# EAGLE design sonar (EAGLE 5.11)
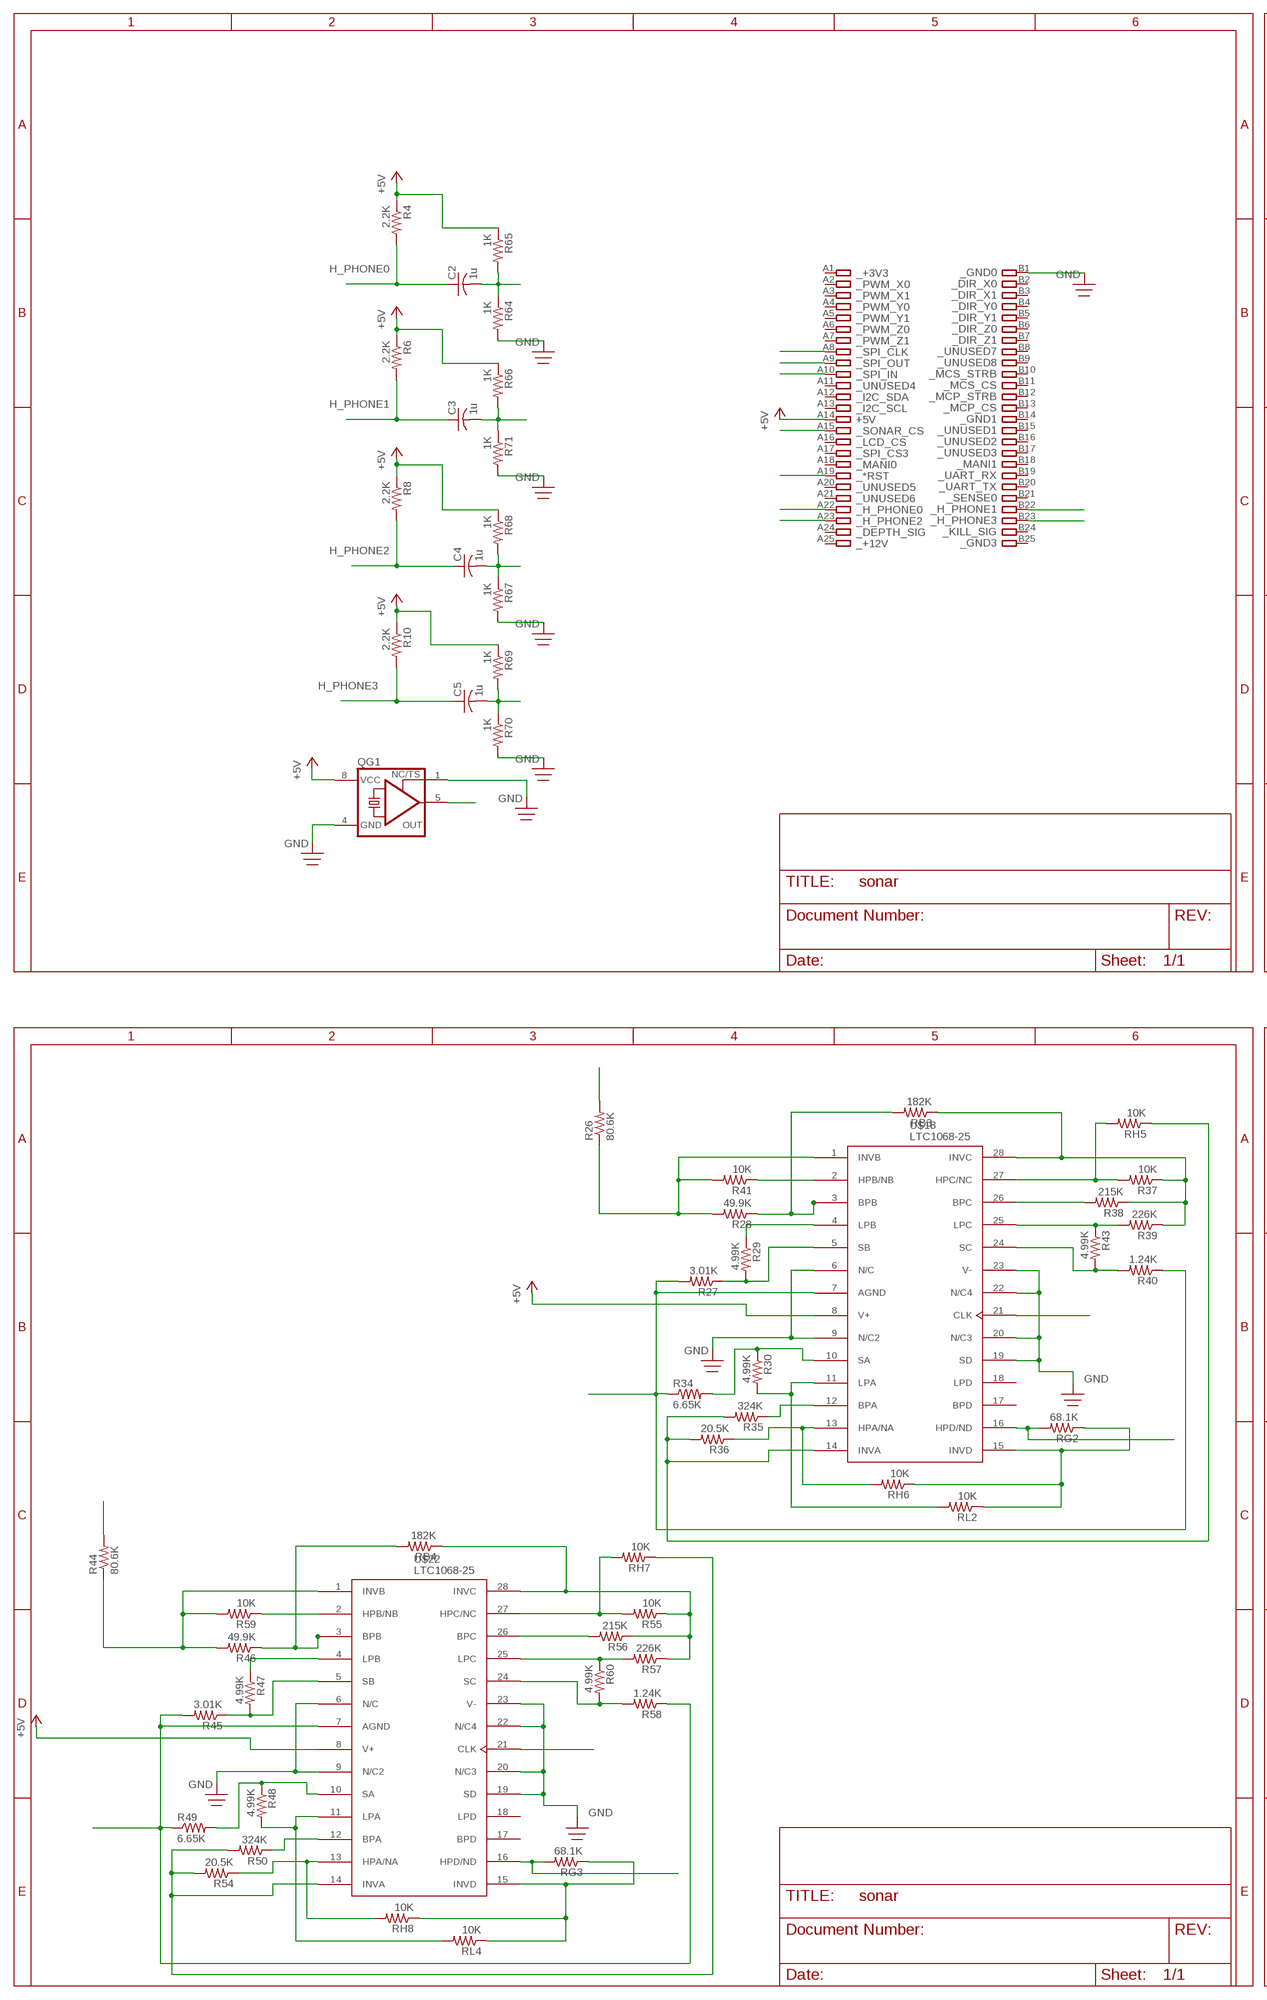
[diagram p0: schematic, sheet 1, part 1 of 2]
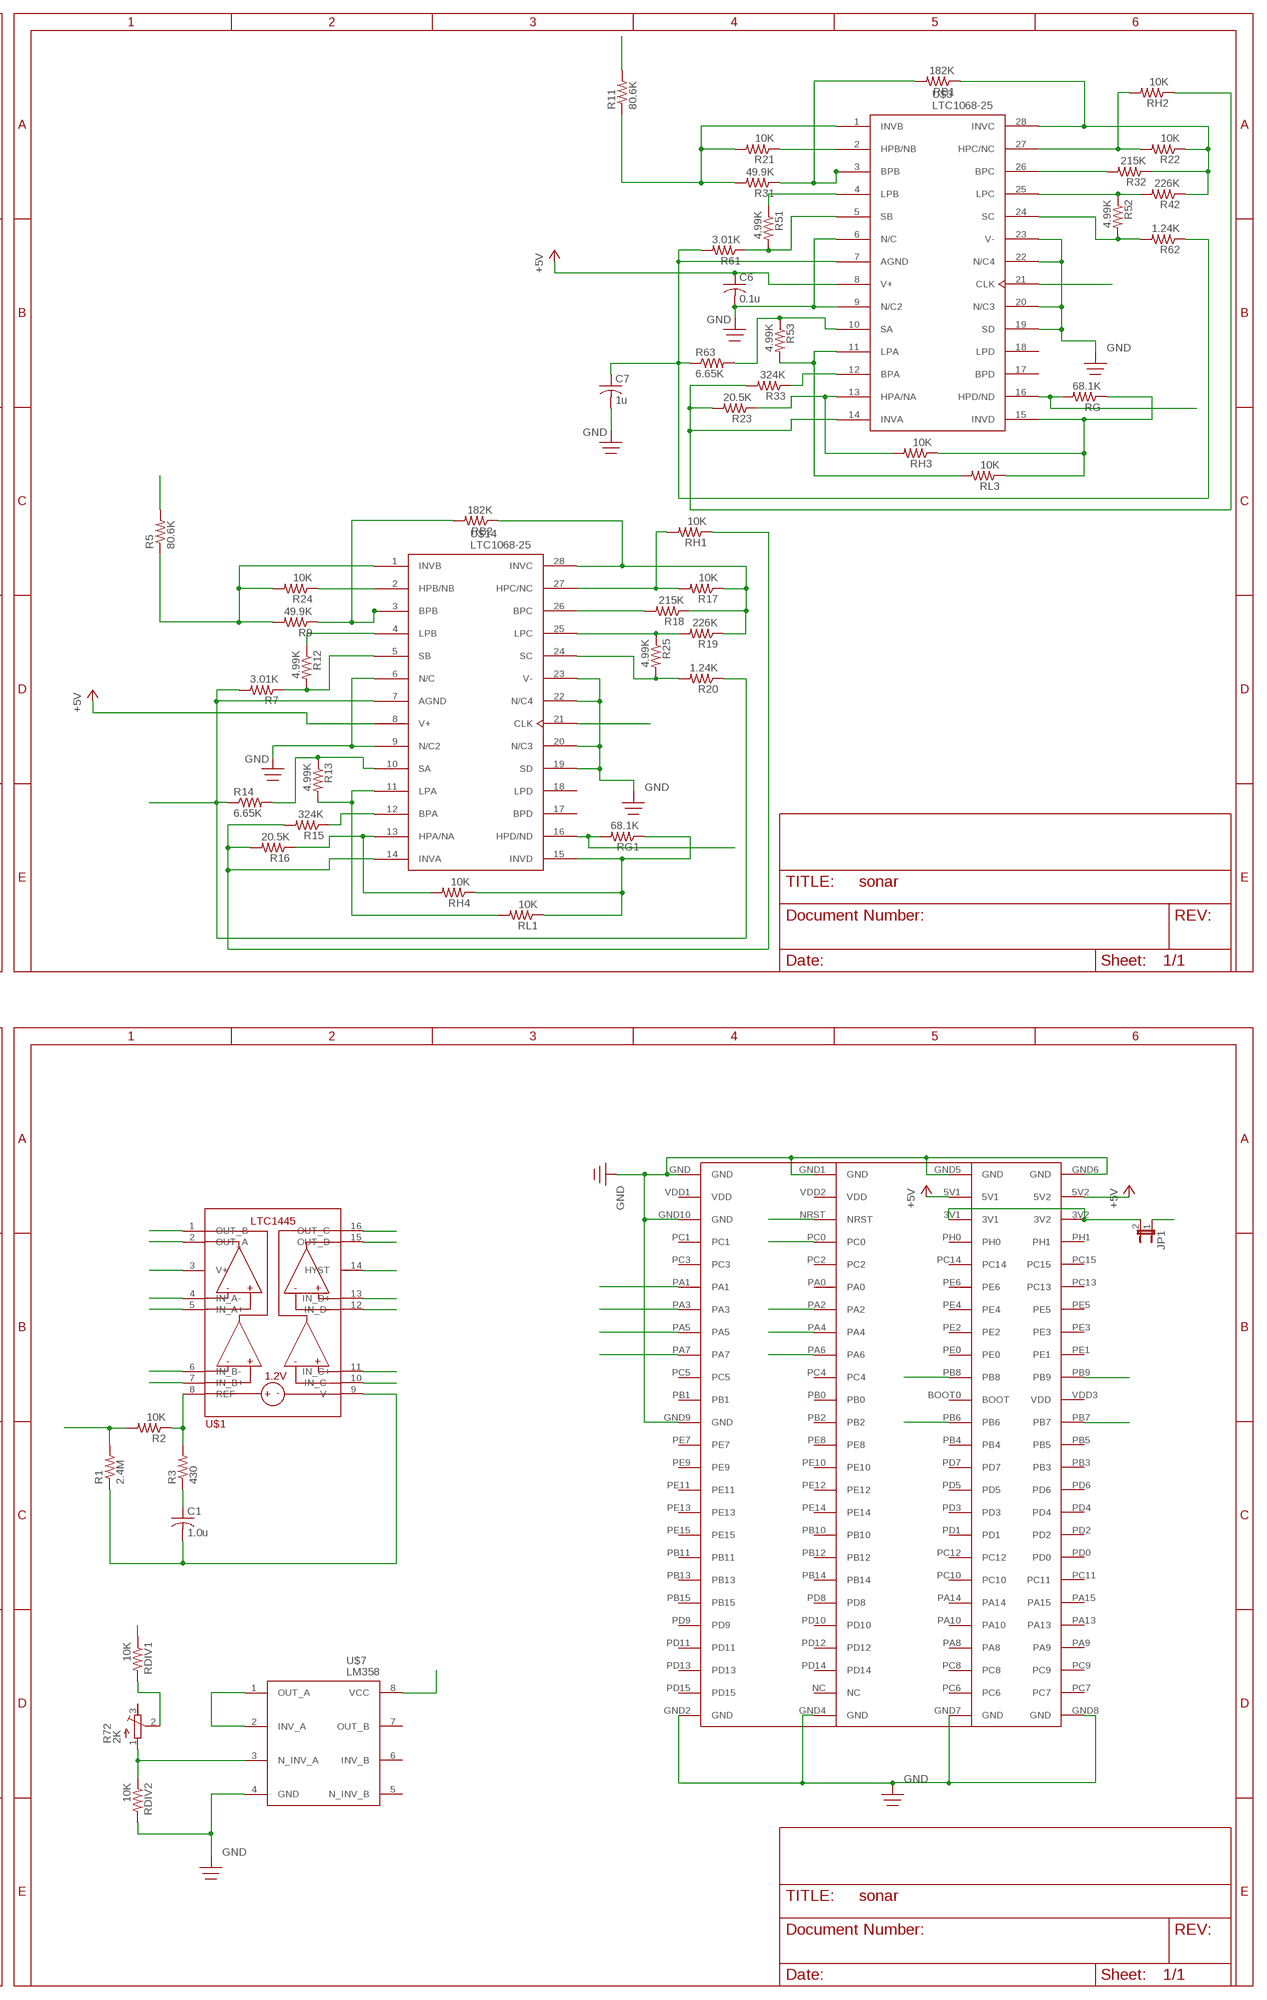
[diagram p1: schematic, sheet 1, part 2 of 2]

## Parts
C1  1.0u  C-USC0805  [C0805]
C2  1u  C-USC0805  [C0805]
C3  1u  C-USC0805  [C0805]
C4  1u  C-USC0805  [C0805]
C5  1u  C-USC0805  [C0805]
C6  0.1u  C-USC0805  [C0805]
C7  1u  C-USC0805  [C0805]
JP1  JP1E  [JP1]
QG1  XO-8  [DIL08S]
R1  2.4M  R-US_R0805  [R0805]
R2  10K  R-US_R0805  [R0805]
R3  430  R-US_R0805  [R0805]
R4  2.2K  R-US_R0805  [R0805]
R5  80.6K  R-US_R0805  [R0805]
R6  2.2K  R-US_R0805  [R0805]
R7  3.01K  R-US_R0805  [R0805]
R8  2.2K  R-US_R0805  [R0805]
R9  49.9K  R-US_R0805  [R0805]
R10  2.2K  R-US_R0805  [R0805]
R11  80.6K  R-US_R0805  [R0805]
R12  4.99K  R-US_R0805  [R0805]
R13  4.99K  R-US_R0805  [R0805]
R14  6.65K  R-US_R0805  [R0805]
R15  324K  R-US_R0805  [R0805]
R16  20.5K  R-US_R0805  [R0805]
R17  10K  R-US_R0805  [R0805]
R18  215K  R-US_R0805  [R0805]
R19  226K  R-US_R0805  [R0805]
R20  1.24K  R-US_R0805  [R0805]
R21  10K  R-US_R0805  [R0805]
R22  10K  R-US_R0805  [R0805]
R23  20.5K  R-US_R0805  [R0805]
R24  10K  R-US_R0805  [R0805]
R25  4.99K  R-US_R0805  [R0805]
R26  80.6K  R-US_R0805  [R0805]
R27  3.01K  R-US_R0805  [R0805]
R28  49.9K  R-US_R0805  [R0805]
R29  4.99K  R-US_R0805  [R0805]
R30  4.99K  R-US_R0805  [R0805]
R31  49.9K  R-US_R0805  [R0805]
R32  215K  R-US_R0805  [R0805]
R33  324K  R-US_R0805  [R0805]
R34  6.65K  R-US_R0805  [R0805]
R35  324K  R-US_R0805  [R0805]
R36  20.5K  R-US_R0805  [R0805]
R37  10K  R-US_R0805  [R0805]
R38  215K  R-US_R0805  [R0805]
R39  226K  R-US_R0805  [R0805]
R40  1.24K  R-US_R0805  [R0805]
R41  10K  R-US_R0805  [R0805]
R42  226K  R-US_R0805  [R0805]
R43  4.99K  R-US_R0805  [R0805]
R44  80.6K  R-US_R0805  [R0805]
R45  3.01K  R-US_R0805  [R0805]
R46  49.9K  R-US_R0805  [R0805]
R47  4.99K  R-US_R0805  [R0805]
R48  4.99K  R-US_R0805  [R0805]
R49  6.65K  R-US_R0805  [R0805]
R50  324K  R-US_R0805  [R0805]
R51  4.99K  R-US_R0805  [R0805]
R52  4.99K  R-US_R0805  [R0805]
R53  4.99K  R-US_R0805  [R0805]
R54  20.5K  R-US_R0805  [R0805]
R55  10K  R-US_R0805  [R0805]
R56  215K  R-US_R0805  [R0805]
R57  226K  R-US_R0805  [R0805]
R58  1.24K  R-US_R0805  [R0805]
R59  10K  R-US_R0805  [R0805]
R60  4.99K  R-US_R0805  [R0805]
R61  3.01K  R-US_R0805  [R0805]
R62  1.24K  R-US_R0805  [R0805]
R63  6.65K  R-US_R0805  [R0805]
R64  1K  R-US_R0805  [R0805]
R65  1K  R-US_R0805  [R0805]
R66  1K  R-US_R0805  [R0805]
R67  1K  R-US_R0805  [R0805]
R68  1K  R-US_R0805  [R0805]
R69  1K  R-US_R0805  [R0805]
R70  1K  R-US_R0805  [R0805]
R71  1K  R-US_R0805  [R0805]
R72  2K  R-TRIMM4G/J  [RTRIM4G/J]
RB1  182K  R-US_R0805  [R0805]
RB2  182K  R-US_R0805  [R0805]
RB3  182K  R-US_R0805  [R0805]
RB4  182K  R-US_R0805  [R0805]
RDIV1  10K  R-US_R0805  [R0805]
RDIV2  10K  R-US_R0805  [R0805]
RG  68.1K  R-US_R0805  [R0805]
RG1  68.1K  R-US_R0805  [R0805]
RG2  68.1K  R-US_R0805  [R0805]
RG3  68.1K  R-US_R0805  [R0805]
RH1  10K  R-US_R0805  [R0805]
RH2  10K  R-US_R0805  [R0805]
RH3  10K  R-US_R0805  [R0805]
RH4  10K  R-US_R0805  [R0805]
RH5  10K  R-US_R0805  [R0805]
RH6  10K  R-US_R0805  [R0805]
RH7  10K  R-US_R0805  [R0805]
RH8  10K  R-US_R0805  [R0805]
RL1  10K  R-US_R0805  [R0805]
RL2  10K  R-US_R0805  [R0805]
RL3  10K  R-US_R0805  [R0805]
RL4  10K  R-US_R0805  [R0805]
U$1  LTC1445  [SO-16]
U$2  STM32F4-DISCOVERY  [STM32F4-DISCOVERY]
U$3  LTC1068-25  [SSOP28]
U$4  CARD_50PIN  [CARD_50PIN]
U$7  LM358  [SO08]
U$14  LTC1068-25  [SSOP28]
U$18  LTC1068-25  [SSOP28]
U$22  LTC1068-25  [SSOP28]

## Nets
+3.3V: JP1.1 RDIV1.1 U$1.3(V+) U$7.8(VCC)
+3V: JP1.2 U$2.3V1 U$2.3V2
+5V: C6.1 QG1.8(VCC) R4.1 R6.1 R8.1 R10.1 R65.1 R66.1 R68.1 R69.1 U$2.5V1 U$2.5V2 U$3.8(V+) U$4.A14 U$14.8(V+) U$18.8(V+) U$22.8(V+)
AGND: C7.1 R7.2 R14.1 R20.1 R27.2 R34.1 R40.1 R45.2 R49.1 R58.1 R61.2 R62.1 R63.1 U$3.7(AGND) U$14.7(AGND) U$18.7(AGND) U$22.7(AGND)
CLK: QG1.5(OUT) U$3.21(CLK) U$14.21(CLK) U$18.21(CLK) U$22.21(CLK)
CS: U$2.PA4 U$4.A15
DGND: C1.2 C6.2 C7.2 QG1.1(TS) QG1.4(GND) R1.1 R64.2 R67.2 R70.2 R71.2 RDIV2.2 U$1.9(V-) U$2.GND U$2.GND1(GND) U$2.GND2(GND) U$2.GND4(GND) U$2.GND5(GND) U$2.GND6(GND) U$2.GND7(GND) U$2.GND8(GND) U$2.GND9(GND) U$2.GND10(GND) U$3.6(N/C) U$3.9(N/C2) U$3.19(SD) U$3.20(N/C3) U$3.22(N/C4) U$3.23(V-) U$4.B1 U$7.4(GND) U$14.6(N/C) U$14.9(N/C2) U$14.19(SD) U$14.20(N/C3) U$14.22(N/C4) U$14.23(V-) U$18.6(N/C) U$18.9(N/C2) U$18.19(SD) U$18.20(N/C3) U$18.22(N/C4) U$18.23(V-) U$22.6(N/C) U$22.9(N/C2) U$22.19(SD) U$22.20(N/C3) U$22.22(N/C4) U$22.23(V-) ; supply symbol labelled GND
H0F: RG.2 U$1.5(IN_A+) U$3.16(HPD/ND)
H1F: RG1.2 U$1.7(IN_B+) U$14.16(HPD/ND)
H2F: RG2.2 U$1.11(IN_C+) U$18.16(HPD/ND)
H3F: RG3.2 U$1.13(IN_D+) U$22.16(HPD/ND)
H_PHONE0: C2.1 R4.2 U$4.A22
H_PHONE0F: C2.2 R11.2 R64.1 R65.2 U$2.PA1
H_PHONE1: C3.1 R6.2 U$4.B22
H_PHONE1F: C3.2 R5.2 R66.2 R71.1 U$2.PA2
H_PHONE2: C4.1 R8.2 U$4.A23
H_PHONE2F: C4.2 R26.2 R67.1 R68.2 U$2.PA3
H_PHONE3: C5.1 R10.2 U$4.B23
H_PHONE3F: C5.2 R44.2 R69.2 R70.1 U$2.PC0
HYST: R1.2 R2.2 U$1.14(HYST)
N$1: R72.1(E) RDIV2.1 U$7.3(N_INV_A)
N$3: R24.1 U$14.2(HPB/NB)
N$4: R21.1 U$3.2(HPB/NB)
N$5: R31.1 RB1.2 U$3.3(BPB)
N$6: R35.2 R36.2 RH5.1 U$18.14(INVA)
N$7: R52.2 R62.2 U$3.24(SC)
N$8: R9.1 RB2.2 U$14.3(BPB)
N$9: R11.1 R21.2 R31.2 U$3.1(INVB)
N$14: R51.1 U$3.4(LPB)
N$15: R51.2 R61.1 U$3.5(SB)
N$16: R5.1 R9.2 R24.2 U$14.1(INVB)
N$17: R53.2 RL3.2 U$3.11(LPA)
N$18: R23.1 RH3.2 U$3.13(HPA/NA)
N$19: C1.1 R3.1
N$20: R53.1 R63.2 U$3.10(SA)
N$21: RG.1 RH3.1 RL3.1 U$3.15(INVD)
N$22: R33.1 U$3.12(BPA)
N$23: R12.1 U$14.4(LPB)
N$24: R23.2 R33.2 RH2.1 U$3.14(INVA)
N$25: R22.1 R32.1 R42.1 RB1.1 U$3.28(INVC)
N$26: R22.2 RH2.2 U$3.27(HPC/NC)
N$27: R32.2 U$3.26(BPC)
N$28: R42.2 R52.1 U$3.25(LPC)
N$34: R7.1 R12.2 U$14.5(SB)
N$35: R13.2 RL1.2 U$14.11(LPA)
N$36: R13.1 R14.2 U$14.10(SA)
N$37: RG1.1 RH4.1 RL1.1 U$14.15(INVD)
N$38: R16.1 RH4.2 U$14.13(HPA/NA)
N$39: R15.1 U$14.12(BPA)
N$40: R15.2 R16.2 RH1.1 U$14.14(INVA)
N$41: R17.1 R18.1 R19.1 RB2.1 U$14.28(INVC)
N$42: R17.2 RH1.2 U$14.27(HPC/NC)
N$43: R18.2 U$14.26(BPC)
N$44: R19.2 R25.1 U$14.25(LPC)
N$45: R20.2 R25.2 U$14.24(SC)
N$46: R41.1 U$18.2(HPB/NB)
N$47: R28.1 RB3.2 U$18.3(BPB)
N$48: R26.1 R28.2 R41.2 U$18.1(INVB)
N$49: R29.1 U$18.4(LPB)
N$50: R27.1 R29.2 U$18.5(SB)
N$51: R30.2 RL2.2 U$18.11(LPA)
N$52: R30.1 R34.2 U$18.10(SA)
N$53: RG2.1 RH6.1 RL2.1 U$18.15(INVD)
N$54: R36.1 RH6.2 U$18.13(HPA/NA)
N$55: R35.1 U$18.12(BPA)
N$57: R37.1 R38.1 R39.1 RB3.1 U$18.28(INVC)
N$58: R37.2 RH5.2 U$18.27(HPC/NC)
N$59: R38.2 U$18.26(BPC)
N$60: R39.2 R43.1 U$18.25(LPC)
N$61: R40.2 R43.2 U$18.24(SC)
N$62: R59.1 U$22.2(HPB/NB)
N$63: R46.1 RB4.2 U$22.3(BPB)
N$64: R44.1 R46.2 R59.2 U$22.1(INVB)
N$65: R47.1 U$22.4(LPB)
N$66: R45.1 R47.2 U$22.5(SB)
N$67: R48.2 RL4.2 U$22.11(LPA)
N$68: R48.1 R49.2 U$22.10(SA)
N$69: RG3.1 RH8.1 RL4.1 U$22.15(INVD)
N$70: R54.1 RH8.2 U$22.13(HPA/NA)
N$71: R50.1 U$22.12(BPA)
N$72: R50.2 R54.2 RH7.1 U$22.14(INVA)
N$73: R55.1 R56.1 R57.1 RB4.1 U$22.28(INVC)
N$74: R55.2 RH7.2 U$22.27(HPC/NC)
N$75: R56.2 U$22.26(BPC)
N$76: R57.2 R60.1 U$22.25(LPC)
N$77: R58.2 R60.2 U$22.24(SC)
N$78: R72.2(S) RDIV1.2
P0: U$1.2(OUT_A) U$2.PB6
P1: U$1.1(OUT_B) U$2.PB7
P2: U$1.16(OUT_C) U$2.PB8
P3: U$1.15(OUT_D) U$2.PB9
REF: R2.1 R3.2 U$1.8(REF)
RST: U$2.NRST U$4.A19
SPI_CLK: U$2.PA5 U$4.A8
SPI_IN: U$2.PA7 U$4.A10
SPI_OUT: U$2.PA6 U$4.A9
VAGND: U$1.4(IN_A-) U$1.6(IN_B-) U$1.10(IN_C-) U$1.12(IN_D-) U$7.1(OUT_A) U$7.2(INV_A)
Unconnected: R72.3(A) U$2.BOOT0(BOOT) U$2.NC U$2.PA0 U$2.PA8 U$2.PA9 U$2.PA10 U$2.PA13 U$2.PA14 U$2.PA15 U$2.PB0 U$2.PB1 U$2.PB2 U$2.PB3 U$2.PB4 U$2.PB5 U$2.PB10 U$2.PB11 U$2.PB12 U$2.PB13 U$2.PB14 U$2.PB15 U$2.PC1 U$2.PC2 U$2.PC3 U$2.PC4 U$2.PC5 U$2.PC6 U$2.PC7 U$2.PC8 U$2.PC9 U$2.PC10 U$2.PC11 U$2.PC12 U$2.PC13 U$2.PC14 U$2.PC15 U$2.PD0 U$2.PD1 U$2.PD2 U$2.PD3 U$2.PD4 U$2.PD5 U$2.PD6 U$2.PD7 U$2.PD8 U$2.PD9 U$2.PD10 U$2.PD11 U$2.PD12 U$2.PD13 U$2.PD14 U$2.PD15 U$2.PE0 U$2.PE1 U$2.PE2 U$2.PE3 U$2.PE4 U$2.PE5 U$2.PE6 U$2.PE7 U$2.PE8 U$2.PE9 U$2.PE10 U$2.PE11 U$2.PE12 U$2.PE13 U$2.PE14 U$2.PE15 U$2.PH0 U$2.PH1 U$2.VDD1(VDD) U$2.VDD2(VDD) U$2.VDD3(VDD) U$3.17(BPD) U$3.18(LPD) U$4.A1 U$4.A2 U$4.A3 U$4.A4 U$4.A5 U$4.A6 U$4.A7 U$4.A11 U$4.A12 U$4.A13 U$4.A16 U$4.A17 U$4.A18 U$4.A20 U$4.A21 U$4.A24 U$4.A25 U$4.B2 U$4.B3 U$4.B4 U$4.B5 U$4.B6 U$4.B7 U$4.B8 U$4.B9 U$4.B10 U$4.B11 U$4.B12 U$4.B13 U$4.B14 U$4.B15 U$4.B16 U$4.B17 U$4.B18 U$4.B19 U$4.B20 U$4.B21 U$4.B24 U$4.B25 U$7.5(N_INV_B) U$7.6(INV_B) U$7.7(OUT_B) U$14.17(BPD) U$14.18(LPD) U$18.17(BPD) U$18.18(LPD) U$22.17(BPD) U$22.18(LPD)

## Library data of the parts
C1-C7 = rcl:C-US: CAPACITOR, American symbol
JP1 = jumper:JP1E: JUMPER
QG1 = crystal:XO-: CRYSTAL; OC_FARNELL: unknown; OC_NEWARK: unknown
R1-R71 RB1-RB4 RDIV1 RDIV2 RG RG1-RG3 RH1-RH8 RL1-RL4 = resistor:R-US_: RESISTOR, American symbol
R72 = resistor:R-TRIMM: Trimm resistor
U$1 = ARVP_Linear_Technology:LTC1445: Designed by Xiaochuan Chen on Feb. 19, 2013
U$2 = ARVP_Linear_Technology:STM32F4-DISCOVERY
U$3 U$14 U$18 U$22 = ARVP_Linear_Technology:LTC1068-25: Created for ARVP by Xiaochuan Chen Feb.15, 2013
U$4 = ARVP:CARD_50PIN
U$7 = ARVP_Linear_Technology:LM358

## Net classes
1 power: width 1.016 mm, drill 0.914 mm, clearance 0.914 mm

## Board
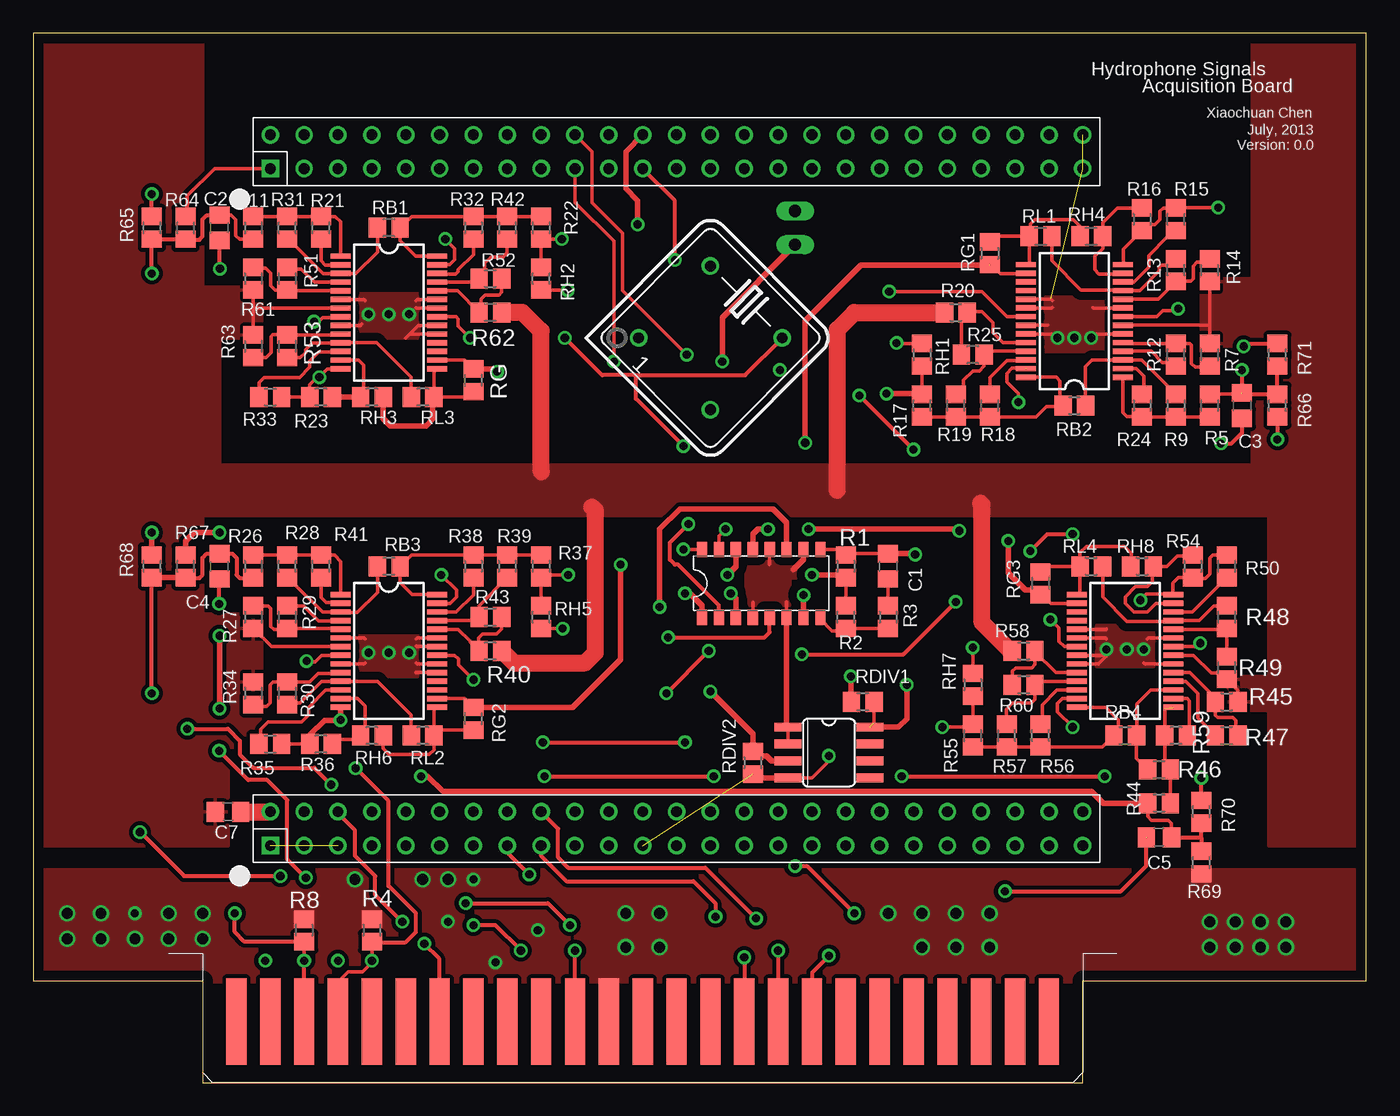
[diagram p2: board, top side]
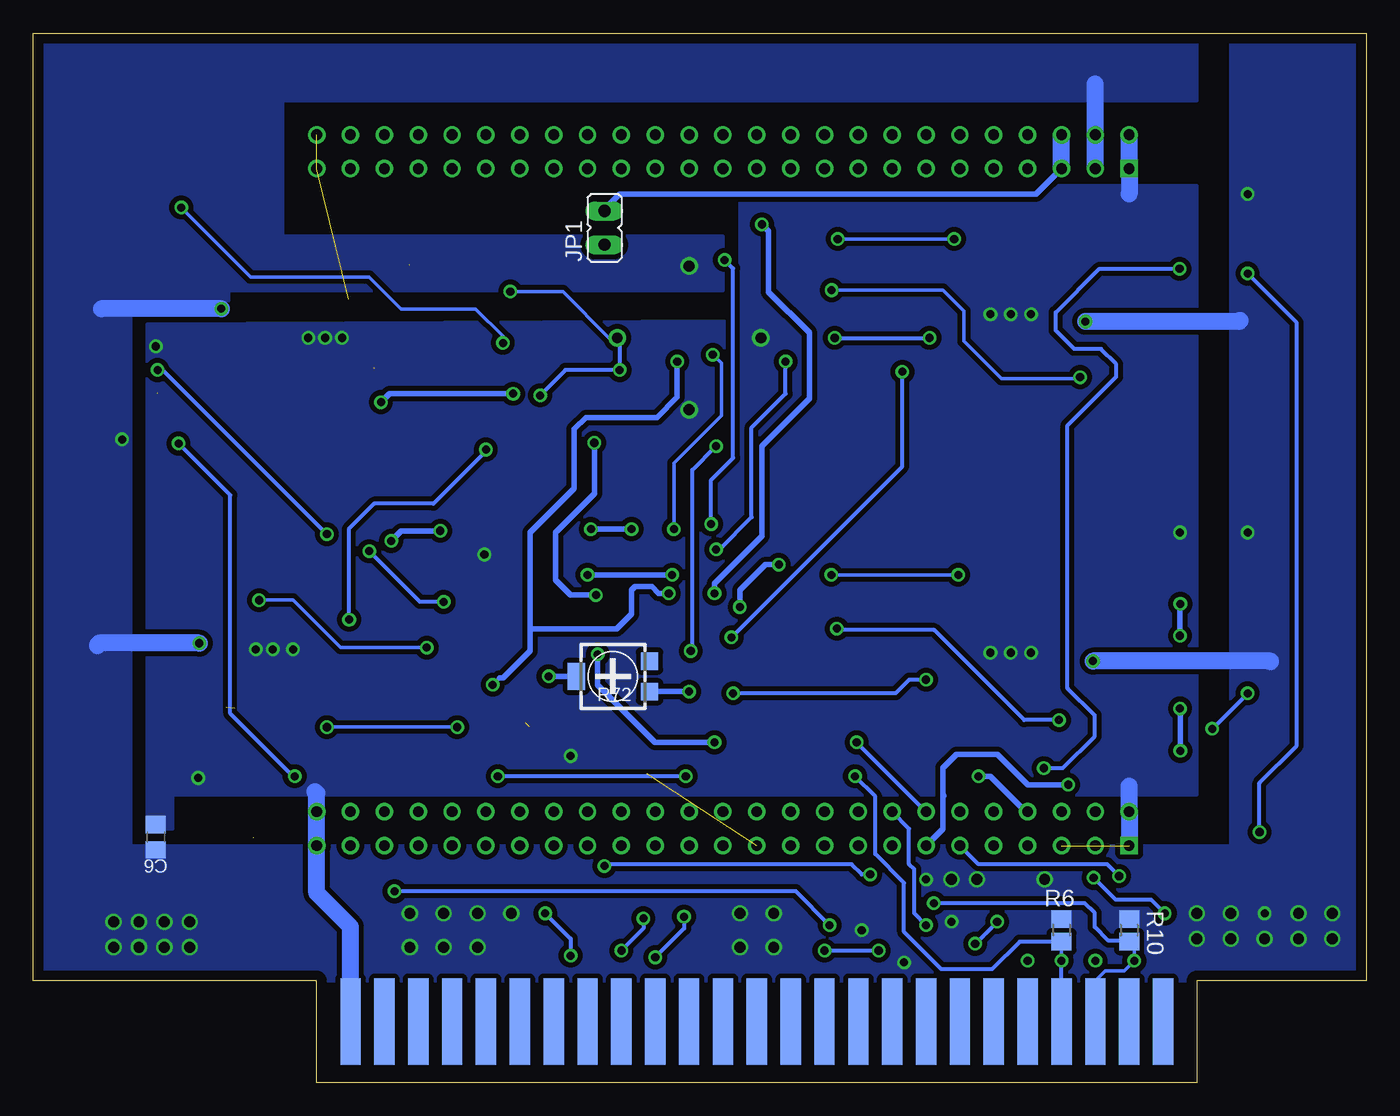
[diagram p3: board, bottom side, seen from below]

Size 100 x 78.73 mm. Coordinates in mm from the lower left corner, seen from the top.
Outline: 100,7.62 100,78.73 0,78.73 0,7.62 12.7,7.62 12.7,0 78.74,0 78.74,7.62 100,7.62
Copper layers (1*16): Top 0.035mm / dielectric 1.5mm / Bottom 0.035mm
Design rules "default *": minimum track width 10mil, minimum drill 24mil, track to track 8mil, track to pad 8mil, pad to pad 8mil, via to via 8mil, smd to smd 8mil, copper to edge 30mil, drill to drill 7mil, minimum pad ring 10mil, minimum via ring 8mil, stop-mask expansion 4mil, vias tented up to drill 0mil, thermal gap 10mil

### Footprints (pad centres in the part's own frame; a part is rotated, then mirrored left to right if it is on the bottom)
C0805 = smd 1.3 x 1.5: 1 -0.95,0; 2 0.95,0
JP1 = drill 0.914 long: 1 0,-1.27; 2 0,1.27
DIL08S = drill 0.813 round: 1 -3.81,-3.81; 4 3.81,-3.81; 5 3.81,3.81; 8 -3.81,3.81
R0805 = smd 1.3 x 1.5: 1 -0.85,0; 2 0.85,0
RTRIM4G/J = smd 1.3 x 1.3: 1 -1.15,-2.75; 3 1.15,-2.75 | smd 2 x 1.3: 2 0,2.75
SO-16 = smd 0.762 x 1.143: 1 -4.445,-2.54; 2 -3.175,-2.54; 3 -1.905,-2.54; 4 -0.635,-2.54; 5 0.635,-2.54; 6 1.905,-2.54; 7 3.175,-2.54; 8 4.445,-2.54; 9 4.445,2.54; 10 3.175,2.54; 11 1.905,2.54; 12 0.635,2.54; 13 -0.635,2.54; 14 -1.905,2.54; 15 -3.175,2.54; 16 -4.445,2.54
STM32F4-DISCOVERY = drill 0.8 round: 3V1 24.13,25.4; 3V2 26.67,25.4; 5V1 24.13,27.94; 5V2 26.67,27.94; BOOT0 24.13,5.08; GND1 -24.13,30.48; GND2 -26.67,25.4; GND4 -26.67,2.54; GND5 -26.67,-30.48; GND6 -24.13,-30.48; GND8 26.67,30.48; GND9 24.13,-30.48; GND10 26.67,-30.48; NC -24.13,-27.94; NRST -24.13,25.4; PA0 -24.13,17.78; PA1 -26.67,17.78; PA2 -24.13,15.24; PA3 -26.67,15.24; PA4 -24.13,12.7; PA5 -26.67,12.7; PA6 -24.13,10.16; PA7 -26.67,10.16; PA8 24.13,-22.86; PA9 26.67,-22.86; PA10 24.13,-20.32; PA13 26.67,-20.32; PA14 24.13,-17.78; PA15 26.67,-17.78; PB0 -24.13,5.08; PB1 -26.67,5.08; PB2 -24.13,2.54; PB3 26.67,-2.54; PB4 24.13,0; PB5 26.67,0; PB6 24.13,2.54; PB7 26.67,2.54; PB8 24.13,7.62; PB9 26.67,7.62; PB10 -24.13,-10.16; PB11 -26.67,-12.7; PB12 -24.13,-12.7; PB13 -26.67,-15.24; PB14 -24.13,-15.24; PB15 -26.67,-17.78; PC0 -24.13,22.86; PC1 -26.67,22.86; PC2 -24.13,20.32; PC3 -26.67,20.32; PC4 -24.13,7.62; PC5 -26.67,7.62; PC6 24.13,-27.94; PC7 26.67,-27.94; PC8 24.13,-25.4; PC9 26.67,-25.4; PC10 24.13,-15.24; PC11 26.67,-15.24; PC12 24.13,-12.7; PC13 26.67,17.78; PC14 24.13,20.32; PC15 26.67,20.32; PD0 26.67,-12.7; PD1 24.13,-10.16; PD2 26.67,-10.16; PD3 24.13,-7.62; PD4 26.67,-7.62; PD5 24.13,-5.08; PD6 26.67,-5.08; PD7 24.13,-2.54; PD8 -24.13,-17.78; PD9 -26.67,-20.32; PD10 -24.13,-20.32; PD11 -26.67,-22.86; PD12 -24.13,-22.86; PD13 -26.67,-25.4; PD14 -24.13,-25.4; PD15 -26.67,-27.94; PE0 24.13,10.16; PE1 26.67,10.16; PE2 24.13,12.7; PE3 26.67,12.7; PE4 24.13,15.24; PE5 26.67,15.24; PE6 24.13,17.78; PE7 -26.67,0; PE8 -24.13,0; PE9 -26.67,-2.54; PE10 -24.13,-2.54; PE11 -26.67,-5.08; PE12 -24.13,-5.08; PE13 -26.67,-7.62; PE14 -24.13,-7.62; PE15 -26.67,-10.16; PH0 24.13,22.86; PH1 26.67,22.86; VDD1 -26.67,27.94; VDD2 -24.13,27.94; VDD3 26.67,5.08 | drill 0.8 square: GND -26.67,30.48; GND7 24.13,30.48
SSOP28 = smd 0.4 x 1.5: 1 -4.225,-3.625; 2 -3.575,-3.625; 3 -2.925,-3.625; 4 -2.275,-3.625; 5 -1.625,-3.625; 6 -0.975,-3.625; 7 -0.325,-3.625; 8 0.325,-3.625; 9 0.975,-3.625; 10 1.625,-3.625; 11 2.275,-3.625; 12 2.925,-3.625; 13 3.575,-3.625; 14 4.225,-3.625; 15 4.225,3.625; 16 3.575,3.625; 17 2.925,3.625; 18 2.275,3.625; 19 1.625,3.625; 20 0.975,3.625; 21 0.325,3.625; 22 -0.325,3.625; 23 -0.975,3.625; 24 -1.625,3.625; 25 -2.275,3.625; 26 -2.925,3.625; 27 -3.575,3.625; 28 -4.225,3.625
CARD_50PIN = smd 1.524 x 6.477: A1 63.5,3.81; A2 60.96,3.81; A3 58.42,3.81; A4 55.88,3.81; A5 53.34,3.81; A6 50.8,3.81; A7 48.26,3.81; A8 45.72,3.81; A9 43.18,3.81; A10 40.64,3.81; A11 38.1,3.81; A12 35.56,3.81; A13 33.02,3.81; A14 30.48,3.81; A15 27.94,3.81; A16 25.4,3.81; A17 22.86,3.81; A18 20.32,3.81; A19 17.78,3.81; A20 15.24,3.81; A21 12.7,3.81; A22 10.16,3.81; A23 7.62,3.81; A24 5.08,3.81; A25 2.54,3.81 | smd 1.524 x 6.477 bottom: B1 63.5,3.81; B2 60.96,3.81; B3 58.42,3.81; B4 55.88,3.81; B5 53.34,3.81; B6 50.8,3.81; B7 48.26,3.81; B8 45.72,3.81; B9 43.18,3.81; B10 40.64,3.81; B11 38.1,3.81; B12 35.56,3.81; B13 33.02,3.81; B14 30.48,3.81; B15 27.94,3.81; B16 25.4,3.81; B17 22.86,3.81; B18 20.32,3.81; B19 17.78,3.81; B20 15.24,3.81; B21 12.7,3.81; B22 10.16,3.81; B23 7.62,3.81; B24 5.08,3.81; B25 2.54,3.81
SO08 = smd 0.66 x 2.032: 1 -1.905,-3.073; 2 -0.635,-3.073; 3 0.635,-3.073; 4 1.905,-3.073; 5 1.905,3.073; 6 0.635,3.073; 7 -0.635,3.073; 8 -1.905,3.073

### Placement (x,y rotation side)
C1  64.14,38.73 90 top
C2  13.97,64.14 90 top
C3  90.68,50.8 90 top
C4  13.97,38.73 90 top
C5  84.45,18.41 0 top
C6  90.81,18.41 90 bottom
C7  14.61,20.32 0 top
JP1  57.15,64.14 0 bottom
QG1  50.8,55.88 315 top
R1  60.96,38.73 270 top
R2  60.96,34.92 90 top
R3  64.14,34.92 270 top
R4  25.4,11.43 270 top
R5  88.27,50.8 90 top
R6  22.86,11.43 270 bottom
R7  88.27,54.61 90 top
R8  20.32,11.43 270 top
R9  85.72,50.8 270 top
R10  17.78,11.43 270 bottom
R11  16.51,64.14 270 top
R12  85.72,54.61 90 top
R13  85.72,60.96 90 top
R14  88.27,60.96 90 top
R15  85.72,64.77 90 top
R16  83.19,64.77 270 top
R17  66.67,50.8 90 top
R18  71.75,50.8 90 top
R19  69.22,50.8 90 top
R20  69.22,57.78 0 top
R21  21.59,64.14 90 top
R22  38.1,64.14 270 top
R23  21.59,51.44 180 top
R24  83.19,50.8 270 top
R25  70.48,54.61 180 top
R26  16.51,38.73 270 top
R27  16.51,34.92 270 top
R28  19.05,38.73 90 top
R29  19.05,34.92 270 top
R30  19.05,29.21 270 top
R31  19.05,64.14 90 top
R32  33.02,64.14 270 top
R33  17.78,51.44 0 top
R34  16.51,29.21 270 top
R35  17.78,25.4 0 top
R36  21.59,25.4 180 top
R37  38.1,38.73 270 top
R38  33.02,38.73 270 top
R39  35.56,38.73 270 top
R40  34.29,32.38 180 top
R41  21.59,38.73 90 top
R42  35.56,64.14 270 top
R43  34.29,34.92 0 top
R44  84.45,20.95 180 top
R45  89.53,28.57 0 top
R46  84.45,23.5 0 top
R47  89.53,26.04 0 top
R48  89.53,34.92 90 top
R49  89.53,31.11 90 top
R50  89.53,38.73 90 top
R51  19.05,60.33 270 top
R52  34.29,60.33 0 top
R53  19.05,55.24 270 top
R54  87,38.73 270 top
R55  70.48,26.04 90 top
R56  75.56,26.04 90 top
R57  73.03,26.04 90 top
R58  74.3,32.38 0 top
R59  85.72,26.04 180 top
R60  74.3,29.84 180 top
R61  16.51,60.33 270 top
R62  34.29,57.78 180 top
R63  16.51,55.24 270 top
R64  11.43,64.14 90 top
R65  8.89,64.14 270 top
R66  93.34,50.8 90 top
R67  11.43,38.73 90 top
R68  8.89,38.73 270 top
R69  87.63,16.51 90 top
R70  87.63,20.32 90 top
R71  93.34,54.61 90 top
R72  56.52,30.48 90 bottom
RB1  26.67,64.14 180 top
RB2  78.11,50.8 0 top
RB3  26.67,38.73 180 top
RB4  81.92,26.04 0 top
RDIV1  62.23,28.57 180 top
RDIV2  53.98,24 270 top
RG  33.02,52.7 90 top
RG1  71.75,62.23 270 top
RG2  33.02,27.3 90 top
RG3  75.56,37.47 270 top
RH1  66.67,54.61 270 top
RH2  38.1,60.33 90 top
RH3  25.4,51.44 180 top
RH4  79.38,63.5 0 top
RH5  38.1,34.92 90 top
RH6  25.4,26.04 180 top
RH7  70.48,29.84 270 top
RH8  83.19,38.73 0 top
RL1  75.56,63.5 0 top
RL2  29.21,26.04 180 top
RL3  29.21,51.44 180 top
RL4  79.38,38.73 0 top
U$1  54.61,37.47 0 top
U$2  48.26,44.45 90 top
U$3  26.67,57.78 270 top
U$4  12.7,0.76 0 top
U$7  59.69,24.77 270 top
U$14  78.11,57.15 90 top
U$18  26.67,32.38 270 top
U$22  81.92,32.38 90 top

### Tracks (layer width: path | path; a pad name or v marks a point on that pad's centre or on a via)
+3.3V  (via drill 0.61)  (1 unrouted)
  Top 0.254: 63.08,26.99 RDIV1.1
  Top 0.406: U$1.3 52.7,36.32 v52.32,36.7 | JP1.1 51.69,57.4 v51.69,54.1 | U$7.8 64.9,26.67 65.53,27.3 v65.53,29.84
  Bottom 0.305: 65.02,30.35 v65.53,29.84
  Bottom 0.406: v52.32,36.7 53.09,36.7 53.59,37.21 54.86,37.21 55.12,36.96 55.12,35.18 56.26,34.04 59.18,34.04 62.74,34.04 | v51.69,54.1 51.69,51.44 53.21,49.91 58.55,49.91 59.44,49.02 59.44,44.58 62.74,41.27 62.74,37.59 62.74,34.04 | 65.02,30.35 64.77,30.35 62.74,32.38 62.74,34.04
+3V
  Bottom 0.406: U$2.3V1 24.77,66.67 56.01,66.67 57.15,65.53 JP1.2
  Bottom 1.27: U$2.3V1 U$2.3V2
+5V  (via drill 0.61, 0.81)
  Top 0.254: U$18.8 21.65,32.06 21.16,31.57 20.55,31.57 v20.5,31.62 | U$22.8 87.3,32.71 v87.55,32.97 | U$14.8 84.3,57.48 84.73,57.91 85.75,57.91 v85.9,58.06 | v21.06,57.1 21.41,57.1 21.72,57.4 22.99,57.4 U$3.8
  Top 0.305: R65.1 v8.89,66.67 | R66.1 v93.34,48.26
  Top 0.406: R68.1 v8.89,41.27
  Bottom 1.27: v20.5,31.62 7.21,31.62 arc90 7.16,31.57 | v21.06,57.1 9.55,57.1 arc-90 9.47,57.17 | v85.9,58.06 94.87,58.06 arc-90 94.89,58.04 | v87.55,32.97 95,32.97 arc-90 95.17,32.79 | U$2.5V1 U$2.5V2 20.32,74.93
  other vias: 2.54,12.7 5.08,12.7 7.62,12.7 10.16,12.7 12.7,12.7 12.7,10.79 10.16,10.79 7.62,10.79 5.08,10.79 2.54,10.79 44.45,12.7 44.45,10.16 46.99,10.16 46.99,12.7 64.14,12.7 66.67,12.7 69.22,10.16 66.67,10.16 71.75,10.16 71.75,12.7 69.22,12.7 88.27,12.06 88.27,10.16 90.17,10.16 90.17,12.06 92.08,12.06 93.98,12.06 93.98,10.16 92.08,10.16 24.13,15.24 29.21,15.24 31.11,15.24 33.02,15.24 31.11,12.06 37.85,11.43 34.67,9.02
  pour Bottom (isolate 0.381, no thermals): 0,78.74 0,7.62 100.08,7.62 100.08,78.74 12.7,78.74 12.7,73.66 81.28,73.66 81.28,63.5 48.26,63.5 48.26,59.44 85.34,59.44 85.34,58.67 92.71,58.67 92.71,17.78 10.16,17.78 10.16,78.74
  pour Top (isolate 0.305, no thermals): 99.69,15.88 91.44,15.88 0,15.88 0,7.62 99.69,7.62
AGND
  Top 0.254: R63.1 16.51,58.11 | U$18.7 17.88,32.71 R27.2 | 16.51,58.11 U$3.7 | 16.51,58.11 R61.2 | 88.27,56.83 R7.2 | 88.27,56.83 U$14.7 87.11,56.83 | 88.27,56.83 R14.1 | U$22.7 87.03,32.06 88.36,30.73 89.08,30.73 R49.1 90.39,29.41 R45.2
  Top 1.27: R20.1 61.59,57.78 60.33,56.52 60.33,44.45 | R40.1 35.18,32.38 36.07,31.5 41.4,31.5 42.16,32.26 42.16,42.93 41.91,43.18 | R58.1 73.3,32.38 71.17,34.52 71.17,43.36 71.07,43.46 | R62.1 36.7,57.78 38.1,56.39 38.1,45.85
  pour Top (isolate 0.305): 13.97,46.35 13.97,55.88 17.14,55.88 17.14,59.69 12.7,59.69 12.7,78.74 0,78.74 0,17.78 14.61,17.78 14.61,25.15 17.14,25.15 17.14,35.18 12.7,35.18 12.7,42.55 92.71,42.55 92.71,30.48 88.9,30.48 88.9,27.94 92.71,27.94 92.71,17.78 100.08,17.78 100.08,78.74 91.44,78.74 91.44,60.33 87.63,60.33 87.63,55.24 91.44,55.24 91.44,46.35
CLK  (via drill 0.61)
  Top 0.254: U$22.21 77.34,32.71 76.94,33.1 76.94,34.1 v76.31,34.74 | U$3.21 31.72,57.46 31.88,57.3 31.88,56.77 v32.77,55.88 | U$18.21 31.62,32.06 31.9,31.77 31.9,31.34 v33.02,30.23 | U$14.21 73.06,57.48 71.17,59.36 v64.21,59.36
  Top 0.305: v61.98,51.56 v66.04,47.5 | v39.88,55.88 42.67,53.09 45.21,53.09 | 45.21,53.09 53.39,53.09 QG1.5 | v47.5,29.21 v50.67,32.38 | v48.77,47.75 45.21,51.31 45.21,53.09
  Bottom 0.254: v76.31,34.74 76.28,34.77 | QG1.5 56.79,55.88 60.27,59.36 v64.21,59.36 | QG1.5 55.93,56.13 | QG1.5 56.01,55.7
  Bottom 0.305: v76.31,34.74 76.33,34.77 76.33,41.53 74.42,43.43 69.98,43.43 66.04,47.37 v66.04,47.5 | v39.88,55.88 v32.77,55.88 | v47.5,29.21 35.31,29.21 34.29,30.23 v33.02,30.23 | 56.01,55.7 v56.01,53.47 60.07,53.47 v61.98,51.56 | v50.67,32.38 50.55,32.51 50.55,45.97 v48.77,47.75
CS  (via drill 0.61)
  Top 0.305: v33.02,11.81 34.67,11.81 v36.58,9.91 | U$4.A15 v40.64,9.91
  Bottom 0.305: U$2.PA4 34.29,19.05 34.29,16.38 33.91,16 33.91,12.7 v33.02,11.81 | v40.64,9.91 v36.58,9.91
DGND  (via drill 0.61)  (4 unrouted)
  Top 0.254: RDIV2.2 54.19,22.86 | U$1.9 60.54,40.01 R1.1 61.06,39.69 C1.2 | U$14.22 76.13,56.83 | U$14.23 76.41,56.17 76.45,56.13 | U$14.19 76.35,58.77 76.45,58.67 | U$14.20 76.41,58.12 76.45,58.17 | U$14.9 79.54,58.12 79.5,58.17 | U$14.6 79.54,56.17 79.5,56.13 | U$22.22 80.46,32.06 80.52,32 79.92,31.41 U$22.23 | U$22.19 80.49,34.01 80.52,34.04 | U$22.20 80.43,33.36 80.52,33.27 | U$22.9 83.65,33.36 83.57,33.27 | U$22.6 83.4,31.41 83.31,31.5 | U$18.22 28.76,32.71 28.7,32.77 | U$18.19 28.73,30.76 28.7,30.73 | U$18.20 28.79,31.41 28.7,31.5 | U$18.23 28.79,33.36 28.7,33.27 | U$18.9 24.81,31.41 24.89,31.5 | U$18.6 24.81,33.36 24.89,33.27 | U$3.23 28.79,58.76 28.7,58.67 | U$3.22 28.76,58.11 28.7,58.17 | U$3.9 24.55,56.81 24.64,56.9 | U$3.6 24.81,58.76 24.89,58.67 | 28.22,56.16 U$3.19 | 28.22,56.16 27.94,55.88 | U$3.20 28.87,56.81 28.22,56.16 | U$7.4 58.42,22.86 59.69,24.13 v59.69,24.51 | 11.56,65.91 11.56,66.55 13.59,68.58 U$2.GND7
  Top 0.305: 11.56,65.91 11.56,65.11 R64.2 | R71.2 91.02,55.46 v90.81,55.24 | R70.2 v87.63,22.86
  Top 0.406: R67.2 11.43,40.64 12.06,41.27 v13.97,41.27 | C1.2 66.11,39.69 v66.17,39.62 | U$7.4 54.27,22.86 RDIV2.2
  Top 1.27: C7.2 U$2.GND1
  Bottom 1.27: U$2.GND8 U$2.GND7 17.78,66.67 | U$2.GND U$2.GND1 17.78,22.23 | 78.87,21.84 78.74,21.72 U$2.GND6 U$2.GND5 78.74,14.22 76.2,11.68 U$4.B1
  other vias: 76.83,55.88 78.11,55.88 79.38,55.88 80.52,32.51 82.04,32.51 83.31,32.51 25.15,32.26 26.67,32.26 28.19,32.26 25.15,57.66 26.67,57.66 28.19,57.66
  pour Bottom (isolate 0.381, no thermals): 12.7,67.31 12.7,21.59 89.53,21.59 89.53,19.05 91.44,19.05 91.44,56.9 46.99,57.15 46.99,67.31
  pour Top (isolate 0.61, no thermals): 75.95,58.93 75.95,54.86 80.26,54.86 80.26,58.93
  pour Top (isolate 0.61, no thermals): 79.76,34.29 79.76,31.24 84.07,31.24 84.07,34.29
  pour Top (isolate 0.61, no thermals): 28.96,33.53 28.96,30.48 24.38,30.48 24.38,33.53
  pour Top (isolate 0.61, no thermals): 28.96,59.18 28.96,55.88 24.38,55.88 24.38,59.18
H0F  (via drill 0.61)
  Top 0.254: U$3.16 32.37,54.21 RG.2
  Top 0.305: v47.62,33.4 54.86,33.4 55.24,33.78 U$1.5
  Top 0.406: RG.2 34.58,53.55 v34.8,53.34
  Bottom 0.305: v34.8,53.34 34.8,46.23 v47.62,33.4
H1F  (via drill 0.61)  (1 unrouted)
  Top 0.254: RG1.2 71.87,61.38 72.54,60.71 74.46,60.71 U$14.16
  Top 0.406: 71.75,61.34 62.1,61.34 57.91,57.15 v57.91,48.01 | U$1.7 v57.78,36.58
  Bottom 0.406: v57.91,48.01 57.91,44.2 60.83,41.27 60.83,37.72 59.69,36.58 v57.78,36.58
H2F  (via drill 0.61)
  Top 0.254: U$18.16 32.37,28.81 RG2.2
  Top 0.406: RG2.2 40.47,28.16 44.07,31.75 v44.07,38.86 | U$1.11 56.52,42.04 55.5,43.05 48.51,43.05 46.99,41.53 v46.99,35.69
  Bottom 0.406: v44.07,38.86 45.09,38.86 46.99,36.96 v46.99,35.69
H3F  (via drill 0.61)
  Top 0.254: RG3.2 75.69,36.62 76.36,35.95 U$22.16
  Top 0.406: v58.17,41.53 69.47,41.53 v69.47,41.4 | v73.15,40.64 73.15,38.23 74.42,36.96 75.22,36.96 RG3.2 | U$1.13 53.98,41.15 54.36,41.53 v55.12,41.53
  Bottom 0.406: v69.47,41.4 72.39,41.4 v73.15,40.64 | v55.12,41.53 v58.17,41.53
H_PHONE0  (via drill 0.61)
  Top 0.254: R4.2 v25.4,9.14 25.4,9.02 24.7,8.32 23.62,8.32 22.86,7.56
  Top 0.305: U$4.A22 22.86,7.56 | v24.18,23.6 26.64,21.13 26.64,14.76 28.7,12.7 28.7,11.3 27.94,10.54 25.44,10.54 R4.2 | v13.99,61.06 13.99,63.16 C2.1
  Bottom 0.305: v24.18,23.6 22.76,23.6 20.37,25.98 20.37,27.56 22.4,29.59 22.4,49.3 18.75,52.96 18.75,53.9 19.89,55.04 21.89,55.04 23.29,56.44 23.29,57.78 20.02,61.06 v13.99,61.06
H_PHONE0F  (via drill 0.61)
  Top 0.254: C2.2 14.85,65.08 15.19,64.75 15.19,63.55 15.47,63.27 16.5,63.27 R11.2
  Top 0.305: C2.2 13.02,65.08 12.7,64.77 12.7,63.5 12.45,63.25 11.47,63.25 R64.1 R65.2 v8.89,60.71 | v18.54,15.49 11.3,15.49 v8,18.8
  Bottom 0.305: U$2.PA1 29.08,16.38 19.43,16.38 v18.54,15.49 | v8,18.8 8,22.48 5.21,25.27 5.21,57.02 v8.89,60.71
H_PHONE1  (via drill 0.61)
  Top 0.305: v89.1,47.95 89.89,47.95 90.7,48.77 90.7,49.83 C3.1 | v38.35,22.99 v51.05,22.99 | v65.15,22.99 v80.39,22.99
  Bottom 0.254: v22.86,9.14 R6.2
  Bottom 0.305: U$4.B22 v22.86,9.14 | v89.1,47.95 85.22,44.07 85.22,27.69 80.52,22.99 v80.39,22.99 | R6.2 26,10.58 28.07,8.51 31.88,8.51 34.67,11.3 34.67,14.99 36.83,17.14 36.83,21.46 v38.35,22.99 | v51.05,22.99 v65.15,22.99
H_PHONE1F  (via drill 0.61)  (1 unrouted)
  Top 0.254: R5.2 90.58,51.65 C3.2
  Top 0.305: R71.1 R66.2 90.78,51.65 C3.2 | v90.68,53.47 90.68,51.69 | v77.98,41.15 76.07,41.15 v74.8,39.88 | v57.66,32.13 65.28,32.13 v69.22,36.07 | v38.23,25.53 v48.9,25.53
  Bottom 0.305: v90.68,53.47 90.3,53.47 v77.98,41.15 | U$2.PA2 v38.23,25.53 | v69.22,36.07 70.99,36.07 v74.8,39.88
  Bottom 0.406: v48.9,25.53 53.34,25.53 57.66,29.84 v57.66,32.13
H_PHONE2  (via drill 0.61)
  Top 0.254: v20.32,9.14 R8.2
  Top 0.305: U$4.A23 v20.32,9.14 | v13.95,24.89 16.13,22.71 17.55,22.71 19.05,21.21 19.05,16.76 v20.45,15.37 | v13.95,35.92 13.95,37.76 C4.1 | R8.2 15.84,10.58 15.11,11.3 v15.11,12.7
  Top 0.406: v13.97,28.07 v13.97,33.53
  Bottom 0.305: v20.45,15.37 18.8,13.72 16.13,13.72 v15.11,12.7
  Bottom 0.406: v13.95,24.89 13.95,28.04 v13.97,28.07 | v13.97,33.53 13.97,35.89 v13.95,35.92
H_PHONE2F  (via drill 0.61)
  Top 0.305: R26.2 16.47,37.85 15.49,37.85 15.24,38.1 15.24,39.37 14.93,39.69 C4.2 13.02,39.69 12.7,39.37 12.7,38.1 12.45,37.85 11.47,37.85 R67.1 | v22.35,22.35 21.08,23.62 16.51,23.62 15.49,24.64 15.49,25.65 14.61,26.54 v11.56,26.54 | v8.89,29.21 R68.2
  Top 0.406: R68.2 R67.1
  Bottom 0.305: v8.89,29.21 v11.56,26.54
  Bottom 0.406: U$2.PA3 31.75,19.05 31.75,21.46 31.69,21.53 31.75,21.59 31.75,23.62 30.73,24.64 27.69,24.64 25.4,22.35 v22.35,22.35
H_PHONE3  (via drill 0.61)  (1 unrouted)
  Top 0.305: 83.52,18.36 83.59,18.29 | C5.1 83.5,16.26 81.6,14.35 v72.9,14.35 | v32.44,13.46 38.61,13.46 v40.26,11.81
  Bottom 0.254: 20.51,4 20.51,5.14 20.45,5.21 20.45,5.33 20.32,5.46 20.32,7.62 19.56,8.38 18.16,8.38 v17.4,9.14 17.4,10.2 R10.2 17.75,10.61 17.75,10.64
  Bottom 0.305: 17.75,10.64 19.33,10.64 20.37,11.68 20.37,12.72 21.11,13.46 v32.44,13.46 | U$4.B23 20.32,7.62 | v40.26,11.81 42.8,14.35 v72.9,14.35
H_PHONE3F  (via drill 0.61)
  Top 0.254: R44.2 83.61,19.98 83.9,19.68 85.14,19.68 85.39,19.43 85.39,18.43 C5.2
  Top 0.305: 87.63,18.41 R69.2 | 87.63,18.41 R70.1 | C5.2 87.63,18.41
  Top 0.406: R44.2 80.26,20.95 79.38,21.84 30.73,21.84 29.59,22.99 v29.08,22.99
  Bottom 0.406: U$2.PC0 25.53,20.32 28.19,22.99 v29.08,22.99
HYST  (via drill 0.61)
  Top 0.254: R1.2 R2.2
  Top 0.406: U$1.14 52.7,38.73 v52.07,38.1 | v58.42,38.1 60.74,38.1 R1.2
  Bottom 0.406: v52.07,38.1 v58.42,38.1
N$1  (via drill 0.61)
  Top 0.406: U$7.3 55.37,24.13 54.99,24.51 54.32,24.51 RDIV2.1 53.98,26.16 v50.8,29.34
  Bottom 0.406: v50.8,29.34 53.76,29.34 R72.1
N$3
  Top 0.254: U$14.2 82.76,53.58 83.31,53.02 83.31,51.78 R24.1
N$4
  Top 0.254: R21.1 21.59,61.67 21.91,61.35 U$3.2
N$5
  Top 0.254: R31.1 19.14,63.28 21.73,60.7 23.03,60.7 U$3.3 23.07,60.68 24.18,60.68 25.82,62.32 RB1.2
N$6  (via drill 0.61)  (1 unrouted)
  Top 0.254: 38.1,33.66 RH5.1 38.11,34.06 v39.71,34.06 | R35.2 R36.2
  Top 0.406: R36.2 20.74,26.07 21.84,27.18 23.02,27.18 v23.05,27.2 v23.05,27.21 U$18.14
  Bottom 0.305: 23.06,27.2 25.65,27.2 32.41,33.96 39.37,33.96 39.47,34.06
  Bottom 0.406: 39.47,34.06 v39.71,34.06
N$7
  Top 0.254: R52.2 35.14,59.3 34.92,59.08 33.91,59.08 33.6,58.78 33.6,57.95 R62.2 31.82,59.41 U$3.24
N$8
  Top 0.254: RB2.2 78.93,50.83 78.93,53.72 79.43,54.23 U$14.3 83.15,54.23 R9.1
N$9
  Top 0.254: R11.1 R31.2 R21.2 22.66,64.98 23.05,64.59 U$3.1
N$14
  Top 0.254: U$3.4 21.11,60.06 20.11,61.05 19.17,61.05 R51.1
N$15
  Top 0.254: U$3.5 19.11,59.41 R51.2 18.13,59.48 17.79,59.81 17.79,60.73 17.43,61.09 16.59,61.09 R61.1
N$16
  Top 0.254: U$14.1 81.73,50.29 82.04,49.97 83.16,49.97 R24.2 R9.2 R5.1
N$17
  Top 0.254: RL3.2 28.33,51.47 28.33,52.94 25.75,55.51 U$3.11 23.03,55.5 20.9,55.5 20.42,55.02 20.42,54.79 20.03,54.4 R53.2
N$18
  Top 0.254: U$3.13 24.39,54.21 24.77,53.84 24.77,51.66 RH3.2
  Top 0.406: R23.1 RH3.2
N$19
  Top 0.254: C1.1 R3.1
N$20
  Top 0.254: R63.2 17.45,54.4 17.83,54.77 17.83,55.99 17.95,56.11 19.04,56.11 R53.1 22.98,56.09 U$3.10
N$21
  Top 0.254: U$3.15 30.06,53.33 RL3.1 32.6,51.44 RG.1
  Top 0.406: RH3.1 26.25,49.82 26.8,49.28 29.46,49.28 29.97,49.78 29.97,51.35 RL3.1
N$22
  Top 0.254: R33.1 16.93,52.52 17.32,52.91 19.96,52.91 20.73,53.67 20.73,54.13 21.41,54.81 23,54.81 U$3.12
N$23
  Top 0.254: U$14.4 83.87,54.88 84.71,54.04 85.45,54.04 R12.1
N$24  (via drill 0.61)
  Top 0.254: R33.2 R23.2 20.74,52.36 21.31,52.93 v21.46,52.93 21.46,52.96 22.05,53.54 23.03,53.54 U$3.14 | RH2.1 40.09,59.48 v40.11,59.46
  Bottom 0.254: v40.11,59.46 31.75,59.46 30.18,57.89 30.18,55.65 27.36,52.83 21.57,52.83 v21.46,52.93
N$25
  Top 0.254: U$3.28 30.29,62 28.68,62 27.52,63.16 RB1.1 28.37,64.98 R32.1 R42.1 R22.1
N$26  (via drill 0.61)
  Top 0.254: RH2.2 R22.2 38.11,63.3 v39.65,63.3 | U$3.27 31.24,61.36 31.62,61.75 31.62,62.59 v30.91,63.3
  Bottom 0.254: v30.91,63.3 v39.65,63.3
N$27
  Top 0.254: R32.2 33.02,62.13 31.88,60.98 31.88,60.86 31.67,60.66 30.35,60.66 U$3.26
N$28
  Top 0.254: U$3.25 33.17,60.06 R52.1 33.86,60.74 33.86,61.47 34.34,61.95 35.23,61.95 35.56,62.28 R42.2
N$34
  Top 0.254: U$14.5 81.8,55.46 R12.2 86.78,55.46 86.89,55.34 86.89,53.96 87.17,53.68 88.19,53.68 R7.1
N$35
  Top 0.254: R13.2 85.25,61.34 84.66,61.34 84.5,61.18 84.5,60.92 83,59.42 U$14.11 81.67,59.48 78.59,59.48 76.42,61.66 RL1.2
N$36
  Top 0.254: R14.2 87.94,61.81 87.72,61.58 87.33,61.58 87.31,61.56 87.3,61.56 87.02,61.28 87.02,60.32 86.83,60.14 85.75,60.14 R13.1 84.39,58.77 U$14.10
N$37
  Top 0.254: RL1.1 74.72,61.38 U$14.15 | RH4.1 78.53,64.25 78.03,64.74 75.14,64.74 74.8,64.4 74.8,63.58 RL1.1 | RL1.1 72.17,63.5 RG1.1
N$38
  Top 0.254: R16.1 81.31,65.62 80.23,64.54 80.23,63.51 RH4.2 80.22,62.59 79.64,62 79.64,61 79.95,60.68 81.69,60.68 U$14.13
N$39
  Top 0.254: U$14.12 82.57,60.08 83.67,61.18 83.67,62.06 85.09,63.48 85.28,63.48 R15.1
N$40  (via drill 0.61)
  Top 0.254: U$14.14 81.79,61.38 81.79,62.52 R16.2 83.67,64.41 83.67,64.42 83.72,64.38 84.16,64.38 84.53,64.76 84.53,65.38 84.78,65.62 R15.2 85.76,65.66 v88.9,65.66 | RH1.1 64.81,55.46 v64.77,55.5
  Bottom 0.254: v64.77,55.5 64.77,56.01 66.8,58.04 72.39,58.04 74.8,60.45 83.69,60.45 v88.9,65.66
N$41
  Top 0.254: U$14.28 76.74,52.92 77.03,52.64 77.03,51.03 RB2.1 77.19,50.74 76.01,50.74 75.22,49.95 R18.1 R19.1 R17.1
N$42  (via drill 0.61)  (1 unrouted)
  Top 0.254: R17.2 66.67,51.69 RH1.2 | v73.91,51.05 73.91,51.69 73.03,52.58 73.03,53.21 73.41,53.59 74.42,53.59
  Top 0.406: v64.01,51.69 66.67,51.69
  Bottom 0.406: v64.01,51.69 73.28,51.69 v73.91,51.05
N$43
  Top 0.254: R18.2 71.75,52.91 73.03,54.18 74.43,54.18 U$14.26
N$44
  Top 0.254: U$14.25 71.6,54.88 R25.1 71.33,53.74 70.99,53.4 70.48,53.4 69.79,52.7 69.79,51.63 69.24,51.63 R19.2
N$45
  Top 0.254: U$14.24 72.75,55.52 72.01,56.26 72.01,57.02 71.18,57.85 70.13,57.85 R20.2 69.64,57.35 R25.2
N$46
  Top 0.254: R41.1 21.59,36.39 21.96,36.02 22.99,36.02 U$18.2
N$47
  Top 0.254: RB3.2 25.82,36.78 24.31,35.27 23.09,35.27 U$18.3 21.69,35.31 19.51,37.49 19.45,37.49 R28.1
N$48
  Top 0.254: R26.1 R28.2 R41.2 22.59,39.59 23.06,39.12 23.06,36.63 U$18.1
N$49
  Top 0.254: R29.1 20.27,35.77 21.4,34.65 23.03,34.65 U$18.4
N$50
  Top 0.254: U$18.5 22.98,34.08 R29.2 18.96,33.98 18.07,33.98 17.82,34.24 17.82,35.59 17.63,35.77 R27.1
N$51
  Top 0.254: RL2.2 28.36,27.57 25.82,30.11 U$18.11 21.63,30.11 20,28.48 19.17,28.48 R30.2
N$52
  Top 0.254: U$18.10 22.98,30.7 21.36,30.7 20.72,30.06 R30.1 18,30.06 17.78,29.84 17.78,28.5 17.52,28.24 16.63,28.24 R34.2
N$53
  Top 0.254: RL2.1 30.06,28.16 U$18.15 | RL2.1 30.06,26.45 RG2.1 | RH6.1 26.25,25.07 26.7,24.62 29.7,24.62 30.06,24.98 RL2.1
N$54
  Top 0.254: R36.1 22.82,25.4 22.82,25.76 24.55,25.76 RH6.2 24.88,26.36 24.88,28.26 24.33,28.81 U$18.13
N$55
  Top 0.254: U$18.12 21.94,29.46 20.64,28.16 20.64,27.6 20.12,27.08 17.62,27.08 17.04,26.5 17.04,26 16.94,25.9 R35.1
N$57
  Top 0.254: R37.1 R39.1 R38.1 28.37,39.59 RB3.1 27.52,37.52 28.42,36.61 U$18.28
N$58  (via drill 0.61)
  Top 0.254: RH5.2 R37.2 38.31,38.1 v40.13,38.1 | U$18.27 31.26,35.96 31.75,36.45 31.75,36.96 v30.61,38.1
  Bottom 0.254: v30.61,38.1 v40.13,38.1
N$59
  Top 0.254: R38.2 33.02,36.6 31.73,35.31 U$18.26
N$60
  Top 0.254: U$18.25 33.17,34.66 R43.1 33.44,35.77 R39.2
N$61
  Top 0.254: R43.2 35.14,34.05 34.76,33.67 33.71,33.67 33.41,33.38 33.41,32.41 R40.2 32.75,33.07 32.75,33.13 31.88,34.01 U$18.24
  Top 0.305: U$18.24
N$62
  Top 0.254: U$22.2 86.58,28.81 86.74,28.65 86.74,26.2 R59.1
N$63
  Top 0.254: R46.1 82.77,24.34 RB4.2 82.8,26.07 82.8,28.42 83.84,29.46 U$22.3
N$64  (1 unrouted)
  Top 0.254: 84.91,28.07 84.91,26.07 R59.2 84.88,23.93 R46.2 R44.1
N$65
  Top 0.254: U$22.4 86.46,30.11 87.36,29.2 87.36,27.36 R47.1
N$66
  Top 0.254: R47.2 90.2,26.21 90.2,27.16 89.98,27.39 88.86,27.39 88.69,27.57 R45.1 88.22,29.04 88.22,29.3 86.77,30.76 U$22.5
N$67
  Top 0.254: R48.2 88.58,35.77 87.47,34.66 U$22.11 85.5,34.62 82.03,34.62 80.22,36.42 RL4.2
N$68
  Top 0.254: R49.2 R48.1 89.47,34.01 U$22.10
N$69
  Top 0.254: RL4.1 78.53,36.84 U$22.15 | RL4.1 75.98,38.73 RG3.1 | RL4.1 78.53,39.77 78.99,40.23 81.84,40.23 82.37,39.7 82.37,38.77 RH8.1
N$70
  Top 0.254: RH8.2 83.77,38.47 | RH8.2 85.05,38.73 85.83,39.52 86.92,39.52 R54.1 | U$22.13 84.22,35.96 83.57,35.31 82.55,35.31 81.92,35.94 81.92,36.45 82.68,37.21 83.57,37.21 83.95,37.59 83.95,38.65 RH8.2
N$71
  Top 0.254: U$22.12 86.95,35.31 88.23,36.59 88.25,36.59 R50.1
N$72  (via drill 0.61)
  Top 0.254: R50.2 88.5,39.59 88.28,39.38 88.28,38.16 87.94,37.83 87.06,37.83 R54.2 85.89,37.88 85.5,37.48 85.5,36.66 | 85.5,36.66 U$22.14 | 85.5,36.66 83.52,36.66 v83.06,36.2 | RH7.1 v70.48,32.64
  Bottom 0.254: v83.06,36.2 80.52,36.2 76.96,32.64 v70.48,32.64
N$73
  Top 0.254: R55.1 R57.1 R56.1 80.22,25.18 RB4.1 81.41,26.38 81.41,27.2 80.45,28.16 U$22.28
N$74  (via drill 0.61)
  Top 0.254: R55.2 70.45,26.92 | R55.2 RH7.2 | U$22.27 77.2,28.81 76.83,28.45 76.83,27.81 v77.98,26.67 | v68.2,26.67 70.27,26.67 R55.2
  Bottom 0.254: v68.2,26.67 v77.98,26.67
N$75
  Top 0.254: U$22.26 76.81,29.46 75.69,28.35 75.69,27.01 R56.2
N$76
  Top 0.254: U$22.25 75.41,30.11 R60.1 75.14,28.74 74.88,28.47 73.46,28.47 73,28.02 73,26.91 R57.2
N$77
  Top 0.254: 75.14,32.33 R58.2 | 75.14,32.33 76.7,30.77 U$22.24 | 75.14,32.33 75.14,31.36 74.91,31.12 73.7,31.12 73.47,30.89 73.47,29.86 R60.2
  Top 0.305: U$22.24 78.27,30.79
N$78  (via drill 0.61)
  Top 0.406: RDIV1.2 61.34,28.61 v61.34,30.48
  Bottom 0.406: v61.34,30.48 R72.2
P0  (via drill 0.61)
  Top 0.305: U$1.2 51.44,35.81 48.39,38.86 48.13,38.86 47.75,39.24 47.75,40.51 v49.15,41.91 | v48.13,61.72 48.13,66.17 U$2.PB6
  Bottom 0.305: v49.15,41.91 49.15,45.21 47.5,46.86 47.5,61.09 v48.13,61.72
P1  (via drill 0.61)
  Top 0.406: U$1.1 50.16,35.81 49.28,36.7 v48.9,36.7 | v45.34,64.39 45.34,66.17 44.45,67.06 44.45,69.85 U$2.PB7
  Bottom 0.406: v48.9,36.7 48.9,37.47 45.34,41.02 45.34,47.75 41.78,51.31 41.78,56.26 44.83,59.31 44.83,63.88 v45.34,64.39
P2  (via drill 0.61)
  Top 0.254: U$1.16 v48.77,40.01 | v43.56,54.1 43.56,63.12 40.64,66.04 U$2.PB8
  Bottom 0.305: v43.56,54.1 43.56,51.69 46.1,49.15 46.1,42.42 48.51,40.01
  Bottom 0.406: v48.77,40.01 48.51,40.01
P3  (via drill 0.61)
  Top 0.254: U$1.15 51.44,41.02 v51.94,41.53 | U$2.PB9 41.91,69.85 41.91,66.04 44.2,63.75 44.2,59.44 v49.02,54.61
  Bottom 0.254: v51.94,41.53 51.94,46.48 48.39,50.04 48.39,53.98 v49.02,54.61
REF
  Top 0.254: U$1.8 59.05,34.78 59.94,33.9 60.78,33.9 R2.1 R3.2
RST  (via drill 0.61)
  Top 0.305: U$4.A19 30.48,9.27 v29.34,10.41 | v27.69,12.06 25.65,14.1 25.65,15.49 24.13,17.02 24.13,18.92 22.86,20.19 U$2.NRST
  Bottom 0.305: v29.34,10.41 v27.69,12.06
SPI_CLK  (via drill 0.61)
  Top 0.305: U$4.A8 58.42,8.26 v59.69,9.53 | v57.15,16.26 58.04,16.26 v61.59,12.7 | U$2.PA5 35.56,17.27 v37.21,15.62
  Bottom 0.305: v59.69,9.53 59.69,10.79 v61.59,12.7 | v37.21,15.62 37.85,15.62 38.61,16.38 57.02,16.38 v57.15,16.26
SPI_IN  (via drill 0.61)
  Top 0.305: U$2.PA7 38.1,17.02 40.01,15.11 49.53,15.11 51.18,13.46 v51.18,12.45 | v53.34,9.4 U$4.A10
  Bottom 0.305: v51.18,12.45 51.18,11.56 v53.34,9.4
SPI_OUT  (via drill 0.61)
  Top 0.305: U$2.PA6 39.37,19.05 39.37,16.89 40.13,16.13 50.42,16.13 v54.23,12.32 | v55.88,9.91 U$4.A9
  Bottom 0.305: v54.23,12.32 54.23,11.56 v55.88,9.91
VAGND
  Top 0.254: U$7.2 U$7.1 | U$1.4 53.98,36.07 | U$1.6 56.52,36.07 | U$1.12 55.24,38.86
  Top 0.406: U$1.6 56.52,26.77 U$7.1 | U$1.10 57.78,39.24 57.02,38.48
  pour Top (isolate 0.61, no thermals): 53.47,39.12 53.47,35.81 56.77,35.81 56.77,37.85 57.78,37.85 57.78,39.12

### Text on the board
tPlace: Hydrophone Signals | Acquisition Board | Xiaochuan Chen | July, 2013 | Version: 0.0